# EAGLE schematic pwd.keep2 (EAGLE 6.5.0)
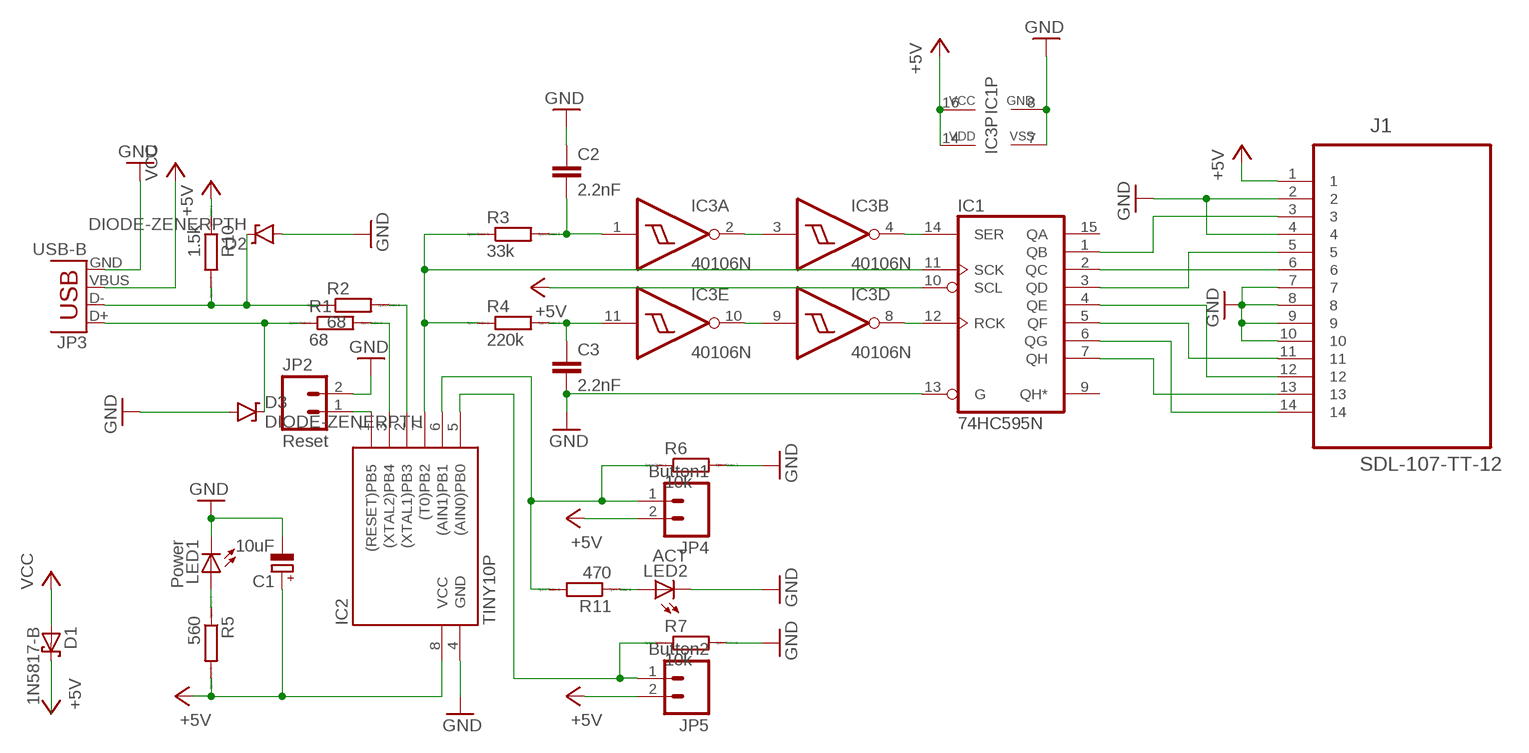
[diagram p0: schematic, sheet 1]

## Parts
C1  10uF  CPOL-EUE2-5  [E2-5]
C2  2.2nF  C-EU050-024X044  [C050-024X044]
C3  2.2nF  C-EU050-024X044  [C050-024X044]
D1  1N5817-B  [DO41-7.6]
D2  DIODE-ZENERPTH  [DIODE-ZENER]
D3  DIODE-ZENERPTH  [DIODE-ZENER]
IC1  74HC595N  [DIL16]
IC2  TINY10P  [DIL08]
IC3  40106N  [DIL14]
J1  SDL-107-TT-12  [SAMTEC_SDL-107-TT-12]
JP2  Reset  M02LOCK  [1X02_LOCK]
JP3  USB-B  USBPTH  [USB-B-PTH]
JP4  Button1  M02LOCK  [1X02_LOCK]
JP5  Button2  M02LOCK  [1X02_LOCK]
LED1  Power  LED5MM  [LED5MM]
LED2  ACT  LED5MM  [LED5MM]
R1  68  R0207/10  [0207/10]
R2  68  R0207/10  [0207/10]
R3  33k  R0207/10  [0207/10]
R4  220k  R0207/10  [0207/10]
R5  560  R0207/10  [0207/10]
R6  10k  R0207/10  [0207/10]
R7  10k  R0207/10  [0207/10]
R10  1.5k  R0207/10  [0207/10]
R11  470  R0207/10  [0207/10]

## Nets
+5V: C1.+ D1.C IC1.10(SCL) IC1.16(VCC) IC2.8(VCC) IC3.14(P:VDD) J1.1 JP4.2 JP5.2 R5.2 R10.1
GND: C1.- C2.1 C3.2 D2.P$2(A) D3.P$2(A) IC1.8(GND) IC1.13(G) IC2.4(GND) IC3.7(P:VSS) J1.2 J1.4 J1.7 J1.8 J1.9 J1.10 JP2.2 JP3.GND LED1.K(C) LED2.K(C) R6.2 R7.2
N$1: IC1.7(QH) J1.13
N$2: IC1.6(QG) J1.14
N$3: IC1.5(QF) J1.11
N$4: IC1.4(QE) J1.12
N$5: IC1.3(QD) J1.5
N$6: IC1.2(QC) J1.6
N$7: IC1.1(QB) J1.3
N$8: D3.P$1(C) JP3.D+ R1.1
N$9: IC2.3((XTAL2)PB4) R1.2
N$10: D2.P$1(C) JP3.D- R2.1 R10.2
N$11: IC2.2((XTAL1)PB3) R2.2
N$12: IC2.1((RESET)PB5) JP2.1
N$13: LED2.A R11.1
N$14: LED1.A R5.1
N$15: IC1.11(SCK) IC2.7((T0)PB2) R3.1 R4.1
N$16: C3.1 IC3.11(E:I) R4.2
N$17: C2.2 IC3.1(A:I) R3.2
N$18: IC2.6((AIN1)PB1) JP4.1 R6.1 R11.2
N$19: IC3.2(A:O) IC3.3(B:I)
N$20: IC2.5((AIN0)PB0) JP5.1 R7.1
N$21: IC1.14(SER) IC3.4(B:O)
N$22: IC1.12(RCK) IC3.8(D:O)
N$23: IC3.9(D:I) IC3.10(E:O)
VCC: D1.A JP3.VBUS
Unconnected: IC1.9(QH*) IC1.15(QA) IC3.5(C:I) IC3.6(C:O) IC3.12(F:O) IC3.13(F:I)

## Library data of the parts
C1 = rcl:CPOL-EU: POLARIZED CAPACITOR, European symbol
C2 C3 = rcl:C-EU: CAPACITOR, European symbol
D1 = diode:1N581*: 1.0A SCHOTTKY BARRIER RECTIFIER Source: http://www.diodes.com/datasheets/ds23001.pdf
D2 D3 = SparkFun-DiscreteSemi:DIODE-ZENER: Zener Diode Production Part - 8199 3.4V Zener Voltage
IC1 = 74xx-eu:74*595: 8-bit SHIFT REGISTER, output latch
IC2 = atmel:TINY10: MICROCONTROLLER 1 Kbytes ROM; OC_FARNELL: unknown; OC_NEWARK: unknown
IC3 = 40xx:40106: Hex SCHMITT TRIGGER
J1 = SAMTEC-BBx-ERx-SLx-SDL_By_element14_Batch_1:SDL-107-TT-12: CONN RECEPTACLE, 2.54MM, THT VERT, 14WAY; MPN: SDL-107-TT-12; OC_FARNELL: 2019227; OC_NEWARK: -; PACKAGE: RECEPTACLE, 2.54MM, THT VERT, 14WAY; SUPPLIER: Samtec
JP2 JP4 JP5 = SparkFun-Connectors:M02: Standard 2-pin 0.1" header. Use with - straight break away headers ( PRT-00116) - right angle break away headers (PRT-00553) - swiss pins (PRT-00743) - machine pins (PRT-00117) - female headers (PRT-00115) Molex polarized connector foot print use with: PRT-08233 with associated crimp pins and housings. 2.54_SCREWTERM for use with PRT-10571. 3.5mm Screw Terminal footprints for PRT-08084 5mm Screw Terminal footprints for use with PRT-08432
JP3 = SparkFun-Connectors:USB: USB Connectors USB-B-PTH is fully proven SKU : PRT-00139/CONN-08278 USB-miniB is fully proven SKU : PRT-00587 USB-A-PCB is untested. USB-A-H is throughly reviewed, but untested. Spark Fun Electronics SKU : PRT-00437 USB-B-SMT is throughly reviewed, but untested. Needs silkscreen touching up. USB-A-S has not been used/tested USB-MB-H has not been used/tested USB-MICROB has been used. CONN-09505; PROD_ID: CONN-08278
LED1 LED2 = led:LED: LED OSRAM: - CHIPLED LG R971, LG N971, LY N971, LG Q971, LY Q971, LO R971, LY R971 LH N974, LH R974 LS Q976, LO Q976, LY Q976 LO Q996 - Hyper CHIPLED LW Q18S LB Q993, LB Q99A, LB R99A - SideLED LS A670, LO A670, LY A670, LG A670, LP A670 LB A673, LV A673, LT A673, LW A673 LH A674 LY A675 LS A676, LA A676, LO A676, LY A676, LW A676 LS A679, LY A679, LG A679 - Hyper Micro SIDELED® LS Y876, LA Y876, LO Y876, LY Y876 LT Y87S - SmartLED LW L88C, LW L88S LB L89C, LB L89S, LG L890 LS L89K, LO L89K, LY L89K LS L896, LA L896, LO L896, LY L896 - TOPLED LS T670, LO T670, LY T670, LG T670, LP T670 LSG T670, LSP T670, LSY T670, LOP T670, LYG T670 LG T671, LOG T671, LSG T671 LB T673, LV T673, LT T673, LW T673 LH T674 LS T676, LA T676, LO T676, LY T676, LB T676, LH T676, LSB T676, LW T676 LB T67C, LV T67C, LT T67C, LS T67K, LO T67K, LY T67K, LW E67C LS E67B, LA E67B, LO E67B, LY E67B, LB E67C, LV E67C, LT E67C LW T67C LS T679, LY T679, LG T679 LS T770, LO T770, LY T770, LG T770, LP T770 LB T773, LV T773, LT T773, LW T773 LH T774 LS E675, LA E675, LY E675, LS T675 LS T776, LA T776, LO T776, LY T776, LB T776 LHGB T686 LT T68C, LB T68C - Hyper Mini TOPLED® LB M676 - Mini TOPLED Santana® LG M470 LS M47K, LO M47K, LY M47K Source: http://www.osram.convergy.de LUXEON: - LUMILED® LXK2-PW12-R00, LXK2-PW12-S00, LXK2-PW14-U00, LXK2-PW14-V00 LXK2-PM12-R00, LXK2-PM12-S00, LXK2-PM14-U00 LXK2-PE12-Q00, LXK2-PE12-R00, LXK2-PE12-S00, LXK2-PE14-T00, LXK2-PE14-U00 LXK2-PB12-K00, LXK2-PB12-L00, LXK2-PB12-M00, LXK2-PB14-N00, LXK2-PB14-P00, LXK2-PB14-Q00 LXK2-PR12-L00, LXK2-PR12-M00, LXK2-PR14-Q00, LXK2-PR14-R00 LXK2-PD12-Q00, LXK2-PD12-R00, LXK2-PD12-S00 LXK2-PH12-R00, LXK2-PH12-S00 LXK2-PL12-P00, LXK2-PL12-Q00, LXK2-PL12-R00 Source: www.luxeon.com KINGBRIGHT: KA-3528ASYC Source: www.kingbright.com
R1-R7 R10 R11 = eagle-ltspice:R: RESISTOR, European symbol; SPICEMODEL: NONE; SPICEPREFIX: R